# Altium schematic sheet SDEC944-xD_SirŠnes_(alim+commande+ouverture).SchDoc: Sirènes (alim+commande+ouverture capot)
size 393 x 270 mm; CompanyName: Seccom; Address1: 521, rue du capt. François Garbit; Address2: 69440 Mornant; Address3: seccom@seccom.fr; Address4: www.seccom.fr; DocumentNumber: 12; SheetNumber: 12; SheetTotal: 22; PageSetup: Record=PageOptions|CenterHorizontal=True|CenterVertical=True|PrintScale=0.74|XCorrection=1.00|YCorrection=1.00|PrintKind=0|BorderSize=5000000|LeftOffset=0|BottomOffset=0|Orientation=2|PaperLength=1000|PaperWidth=1000|Scale=100|PaperSource=7|PrintQuality=-4|MediaType=1|DitherType=10|PaperKind=A4|PrintScaleMode=1
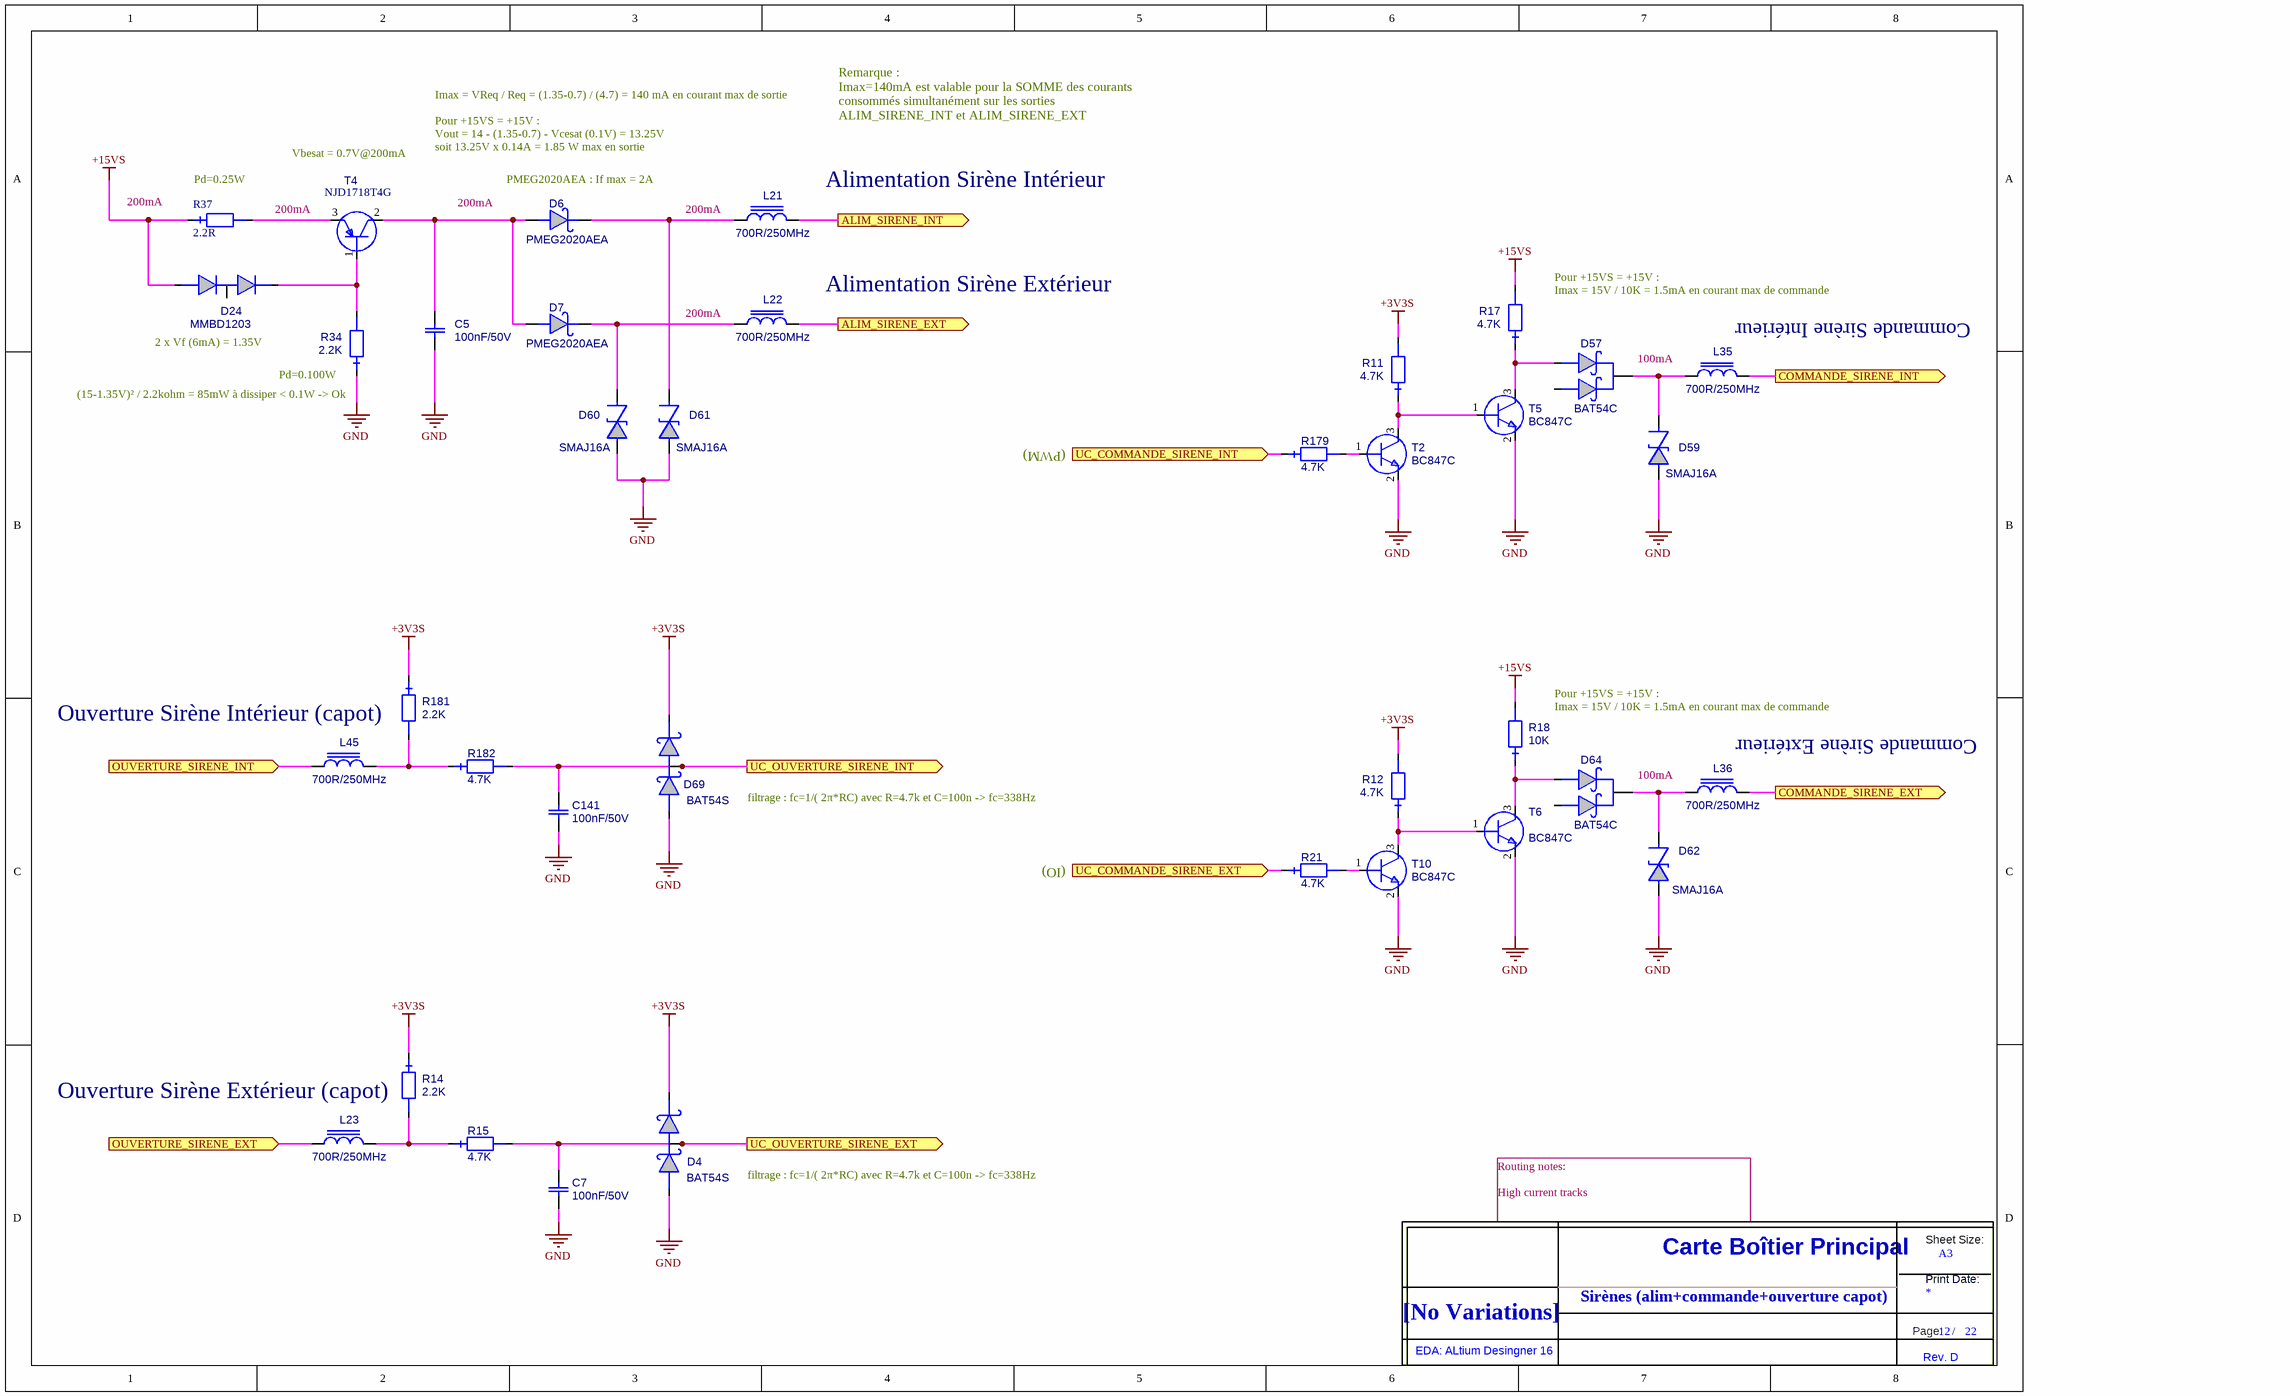
[diagram p0: SDEC944-xD_SirŠnes_(alim+commande+ouverture).SchDoc]

## Parts
C5  value 100nF/50V  [0603_ReflowSoldering_CAP]  (hidden comment: C_0603_X7R_10%_100N-50V)
C7  value 100nF/50V  [0603_ReflowSoldering_CAP]  (hidden comment: C_0603_X7R_10%_100N-50V)
C141  value 100nF/50V  [0603_ReflowSoldering_CAP]  (hidden comment: C_0603_X7R_10%_100N-50V)
D4  BAT54S  [SOT23_3L_ReflowSoldering]
D6  PMEG2020AEA  [SOD323_ReflowSoldering]
D7  PMEG2020AEA  [SOD323_ReflowSoldering]
D24  MMBD1203  [SOT23_3L_ReflowSoldering]
D57  BAT54C  [SOT23_3L_ReflowSoldering]
D59  SMAJ16A  [DO214AC-SMA-P_ReflowSoldering]
D60  SMAJ16A  [DO214AC-SMA-P_ReflowSoldering]
D61  SMAJ16A  [DO214AC-SMA-P_ReflowSoldering]
D62  SMAJ16A  [DO214AC-SMA-P_ReflowSoldering]
D64  BAT54C  [SOT23_3L_ReflowSoldering]
D69  BAT54S  [SOT23_3L_ReflowSoldering]
L21  value 700R/250MHz  [0603_ReflowSoldering_CAP]  (hidden comment: IND_FERRITE_0603_742792643)
L22  value 700R/250MHz  [0603_ReflowSoldering_CAP]  (hidden comment: IND_FERRITE_0603_742792643)
L23  value 700R/250MHz  [0603_ReflowSoldering_CAP]  (hidden comment: IND_FERRITE_0603_742792643)
L35  value 700R/250MHz  [0603_ReflowSoldering_CAP]  (hidden comment: IND_FERRITE_0603_742792643)
L36  value 700R/250MHz  [0603_ReflowSoldering_CAP]  (hidden comment: IND_FERRITE_0603_742792643)
L45  value 700R/250MHz  [0603_ReflowSoldering_CAP]  (hidden comment: IND_FERRITE_0603_742792643)
R11  value 4.7K  [0603_ReflowSoldering_RES]  (hidden comment: RES_0603_1%_100PPM_4.7K)
R12  value 4.7K  [0603_ReflowSoldering_RES]  (hidden comment: RES_0603_1%_100PPM_4.7K)
R14  value 2.2K  [0603_ReflowSoldering_RES]  (hidden comment: RES_0603_1%_100PPM_2.2K)
R15  value 4.7K  [0603_ReflowSoldering_RES]  (hidden comment: RES_0603_1%_100PPM_4.7K)
R17  value 4.7K  [0603_ReflowSoldering_RES]  (hidden comment: RES_0603_1%_100PPM_4.7K)
R18  value 10K  [0603_ReflowSoldering_RES]  (hidden comment: RES_0603_1%_100PPM_10K)
R21  value 4.7K  [0603_ReflowSoldering_RES]  (hidden comment: RES_0603_1%_100PPM_4.7K)
R34  value 2.2K  [0603_ReflowSoldering_RES]  (hidden comment: RES_0603_1%_100PPM_2.2K)
R37  Resistance (Ohms): 2.2R  [1206_ReflowSoldering_RES]  (hidden comment: RES SMD 2.2 OHM 1% 1/4W 1206)
R179  value 4.7K  [0603_ReflowSoldering_RES]  (hidden comment: RES_0603_1%_100PPM_4.7K)
R181  value 2.2K  [0603_ReflowSoldering_RES]  (hidden comment: RES_0603_1%_100PPM_2.2K)
R182  value 4.7K  [0603_ReflowSoldering_RES]  (hidden comment: RES_0603_1%_100PPM_4.7K)
T2  BC847C  [SOT23_3L_ReflowSoldering]
T4  NJD1718T4G  [DPAK_Specifique_1]
T5  BC847C  [SOT23_3L_ReflowSoldering]
T6  BC847C  [SOT23_3L_ReflowSoldering]
T10  BC847C  [SOT23_3L_ReflowSoldering]
Title_new  DNI  (value not drawn)  (graphical)

## Ports
ALIM_SIRENE_EXT (out), ALIM_SIRENE_INT (out), COMMANDE_SIRENE_EXT (out), COMMANDE_SIRENE_INT (out), OUVERTURE_SIRENE_EXT (in), OUVERTURE_SIRENE_INT (in), UC_COMMANDE_SIRENE_EXT (in), UC_COMMANDE_SIRENE_INT (in), UC_OUVERTURE_SIRENE_EXT (out), UC_OUVERTURE_SIRENE_INT (out)

## Nets
+3V3S: D4.2 D69.2 R11.2 R12.2 R14.1 R181.1
+15VS: D24.1 R17.2 R18.2 R37.1
GND: C5.2 C7.2 C141.2 D4.1 D59.A D60.A D61.A D62.A D69.1 R34.1 T2.2(E) T5.2(E) T6.2(E) T10.2(E)
ALIM_SIRENE_EXT: L22.2 ; port ALIM_SIRENE_EXT
ALIM_SIRENE_INT: L21.2 ; port ALIM_SIRENE_INT
COMMANDE_SIRENE_EXT: L36.2 ; port COMMANDE_SIRENE_EXT
COMMANDE_SIRENE_INT: L35.2 ; port COMMANDE_SIRENE_INT
OUVERTURE_SIRENE_EXT: L23.1 ; port OUVERTURE_SIRENE_EXT
OUVERTURE_SIRENE_INT: L45.1 ; port OUVERTURE_SIRENE_INT
UC_COMMANDE_SIRENE_EXT: R21.1 ; port UC_COMMANDE_SIRENE_EXT
UC_COMMANDE_SIRENE_INT: R179.1 ; port UC_COMMANDE_SIRENE_INT
UC_OUVERTURE_SIRENE_EXT: C7.1 D4.3 R15.2 ; port UC_OUVERTURE_SIRENE_EXT
UC_OUVERTURE_SIRENE_INT: C141.1 D69.3 R182.2 ; port UC_OUVERTURE_SIRENE_INT
NetC5_1: C5.1 D6.A D7.A T4.2(C)
NetD6_K: D6.K D61.K L21.1
NetD7_K: D7.K D60.K L22.1
NetD24_2: D24.2 R34.2 T4.1(B)
NetD57_2: D57.2 R17.1 T5.3(C)
NetD57_3: D57.3 D59.K L35.1
NetD62_K: D62.K D64.3 L36.1
NetD64_2: D64.2 R18.1 T6.3(C)
NetL23_2: L23.2 R14.2 R15.1
NetL45_2: L45.2 R181.2 R182.1
NetR11_1: R11.1 T2.3(C) T5.1(B)
NetR12_1: R12.1 T6.1(B) T10.3(C)
NetR21_2: R21.2 T10.1(B)
NetR37_2: R37.2 T4.3(E)
NetR179_2: R179.2 T2.1(B)

Not connected (* = marked no-connect by the designer): D24 3; D57 1; D64 1

## Notes on the sheet
- Imax = VReq / Req = (1.35-0.7) / (4.7) = 140 mA en courant max de sortie
- Vbesat = 0.7V@200mA
- soit 13.25V x 0.14A = 1.85 W max en sortie
- Vout = 14 - (1.35-0.7) - Vcesat (0.1V) = 13.25V
- Pour +15VS = +15V :
- Remarque :
  Imax=140mA est valable pour la SOMME des courants consommés simultanément sur les sorties ALIM_SIRENE_INT et ALIM_SIRENE_EXT
- (near R37) 200mA
- (near R37) Pd=0.25W
- 200mA
- (near D6) PMEG2020AEA : If max = 2A
- (near L21) 200mA
- (near L21) Alimentation Sirène Intérieur
- Alimentation Sirène Extérieur
- (near R17) Imax = 15V / 10K = 1.5mA en courant max de commande
- (near R17) Pour +15VS = +15V :
- 2 x Vf (6mA) = 1.35V
- (near R34) Pd=0.100W
- (near L22) 200mA
- 100mA
- (near L35) Commande Sirène Intérieur
- (near R34) (15-1.35V)² / 2.2kohm = 85mW à dissiper < 0.1W -> Ok
- (PWM)
- (near R18) Pour +15VS = +15V :
- (near R181) Ouverture Sirène Intérieur (capot)
- (near R18) Imax = 15V / 10K = 1.5mA en courant max de commande
- (near L36) Commande Sirène Extérieur
- filtrage : fc=1/( 2π*RC) avec R=4.7k et C=100n -> fc=338Hz
- (IO)
- (near R14) Ouverture Sirène Extérieur (capot)
- Routing notes:
  High current tracks
- Sirènes (alim+commande+ouverture capot)
- (in symbol Title_new) Sheet Size:; Carte Boîtier Principal; A3; Print Date:; [No Variations]; Page:; /; EDA: ALtium Desingner 16; Rev. D

## Library data of the parts
C5 C7 C141 = C_0603_X7R_10%_100N-50V: Condensateur céramique, X7R, 10%, CMS 0603, 100nF/50V; Creation: FB (29/02/12); Boitier: 0603; Remarque: {Remarque}; Fabricant: Kemet; Ref Fab: C0603C104K5RAC; Coeff: 1; ComponentLink1URL: O:\_Documentation\Datasheets\Kemet\Condos_Ceramic_CMS.pdf; ComponentLink2URL: o:\_Documentation\Datasheets\_BOITIERS\PASSIF_CMS\; Config: *; ComponentLink1Description: Datasheet; ComponentLink2Description: Datasheet Boitier; Supplier 1: Farnell; Supplier Part Number 1: 1288255
D4 D69 = BAT54S: Diode Schottky double, BAT54 en série, Vrrm=30V, If=200mA, Vf=0.4Vmax, CMS; Creation: JMP 05/09/2002; Verification: GO (26/09/02); Reference: 000206/00; Boitier: SOT23_3L; Remarque: {Remarque}; Coeff: 1; Fabricant: NXP; ComponentLink1URL: O:\_Documentation\Datasheets\NXP\BAT54_series.pdf; ComponentLink2URL: o:\_Documentation\Datasheets\_BOITIERS\ACTIF_CMS\SOT\SOT_23_3P_(Schneider).PDF; Config: *; ComponentLink1Description: Datasheet; ComponentLink2Description: Datasheet Boitier; Ref Fab: BAT54S; Supplier 1: Farnell; Supplier Part Number 1: 1081194; Value: BAT54S; Supplier 2: Mouser; Supplier Part Number 2: 771-BAT54S-T/R
D6 D7 = PMEG2020AEA: Diode Schottky, Vrrm=20V, If=2A, Vf=0.45V, CMS; Creation: PDP (10/07/12); Boitier: SOD323; Remarque: {Remarque}; Coeff: 1; Fabricant: NXP; Verification: *; ComponentLink1URL: o:\_Documentation\Datasheets\NXP\PMEG2020AEA.PDF; ComponentLink2URL: o:\_Documentation\Datasheets\_BOITIERS\ACTIF_CMS\SOD\SOD_80_(MLL34)_(Schneider).PDF; Config: *; ComponentLink1Description: Datasheet; ComponentLink2Description: Datasheet Boitier; Ref Fab: PMEG2020AEA; Value: PMEG2020AEA
D24 = MMBD1203: Diode de Redressement double, en série, Vrrm=100V, If=200mA, Vf=1V, rapide (trr=4ns), CMS; Creation: LJ (28/04/11); Reference: 001730/00; Boitier: SOT23_3L; Remarque: {Remarque}; Coeff: 1; Fabricant: Fairchild; ComponentLink1URL: o:\_Documentation\Datasheets\Fairchild\MMBD1201-2-3-4-5.pdf; ComponentLink2URL: o:\_Documentation\Datasheets\_BOITIERS\ACTIF_CMS\SOT\SOT_23_3P_(Schneider).PDF; Config: *; ComponentLink1Description: Datasheet; ComponentLink2Description: Datasheet Boitier; Supplier 1: Farnell; Supplier 2: Mouser; Supplier Part Number 1: 1700901; Supplier Part Number 2: 512-MMBD1203; Ref Fab: MMBD1203; Value: MMBD1203
D57 D64 = BAT54C: Diode Schottky double, BAT54 cathode com, Vrrm=30V, If=300mA, Vf=0.4Vmax, CMS; Creation: LJ (14/05/02); Reference: 000597/00; Boitier: SOT23_3L; Remarque: {Remarque}; Coeff: 1; Fabricant: NXP; Verification: LJ (14/05/02); ComponentLink1URL: O:\_Documentation\Datasheets\NXP\BAT54_series.pdf; ComponentLink2URL: o:\_Documentation\Datasheets\_BOITIERS\ACTIF_CMS\SOT\SOT_23_3P_(Schneider).PDF; Config: *; ComponentLink1Description: Datasheet; ComponentLink2Description: Datasheet Boitier; Ref Fab: BAT54C; Supplier 1: Farnell; Supplier Part Number 1: 1081192; Value: BAT54C
D59-D62 = SMAJ16A: Diode Transil/TVS unidirectionnelle (A), Transzorb, 400W, 16V, CMS; Creation: ZA (29/07/13); Boitier: DO214AC/SMA; Remarque: {Remarque}; Coeff: 1; Fabricant: Bourns; ComponentLink1URL: o:\_Documentation\Datasheets\Bourns\SMAJ-74970.pdf; ComponentLink2URL: o:\_Documentation\Datasheets\_BOITIERS\ACTIF_CMS\SMx\SMB_(Schneider).lnk; Config: *; ComponentLink1Description: Datasheet; ComponentLink2Description: Datasheet Boitier; Ref Fab: SMAJ16A; Supplier 1: Farnell; Supplier Part Number 1: 1843352; Supplier 2: Mouser; Supplier Part Number 2: 652-SMAJ16A; Value: SMAJ16A
L21-L23 L35 L36 L45 = IND_FERRITE_0603_742792643: Inductance à ferrite multicouches CMS, imp=700R@250MHz, +/-25%, Rdc=350mR, I=400mA; Creation: PDP (02/08/12); Boitier: 0603; Coeff: 1; Fabricant: Wurth Elektronik; ComponentLink1URL: o:\_Documentation\Datasheets\Murata\Ferrite_BLM21P.pdf; Config: *; ComponentLink1Description: Datasheet; ComponentLink2Description: Datasheet Boitier; Ref Fab: 742792643; Supplier 1: Farnell; Supplier Part Number 1: 1800349
R11 R12 R15 R17 R21 R179 R182 = RES_0603_1%_100PPM_4.7K: Résistance, 0.100W, 1%, 100ppm, 75V, 4.7K; Creation: JPL (05/07/12); Boitier: 0603; Remarque: {Remarque}; Fabricant: Vishay; Ref Fab: CRCW06034K70FKEA; Coeff: 1; Verification: *; ComponentLink1URL: O:\_Documentation\Datasheets\Vishay\Resistances_D-CRCWe3.pdf; ComponentLink2URL: o:\_Documentation\Datasheets\_BOITIERS\PASSIF_CMS\; Config: *; ComponentLink1Description: Datasheet; ComponentLink2Description: Datasheet Boitier; Supplier 1: Farnell; Supplier 2: RadioSpares; Supplier Part Number 1: 1469807; Supplier Part Number 2: 6790484
R14 R34 R181 = RES_0603_1%_100PPM_2.2K: Résistance, 0.100W, 1%, 100ppm, 75V, 2.2K; Creation: JPL (05/07/12); Boitier: 0603; Remarque: {Remarque}; Fabricant: Vishay; Ref Fab: CRCW06032K20FKEA; Coeff: 1; Verification: *; ComponentLink1URL: O:\_Documentation\Datasheets\Vishay\Resistances_D-CRCWe3.pdf; ComponentLink2URL: o:\_Documentation\Datasheets\_BOITIERS\PASSIF_CMS\; Config: *; ComponentLink1Description: Datasheet; ComponentLink2Description: Datasheet Boitier; Supplier 1: Farnell; Supplier 2: RadioSpares; Supplier Part Number 1: 1469765; Supplier Part Number 2: 6790112
R18 = RES_0603_1%_100PPM_10K: Résistance, 0.100W, 1%, 100ppm, 75V, 10K; Creation: JPL (05/07/12); Boitier: 0603; Remarque: {Remarque}; Fabricant: Vishay; Ref Fab: CRCW060310K0FKEA; Coeff: 1; Verification: *; ComponentLink1URL: O:\_Documentation\Datasheets\Vishay\Resistances_D-CRCWe3.pdf; ComponentLink2URL: o:\_Documentation\Datasheets\_BOITIERS\PASSIF_CMS\; Config: *; ComponentLink1Description: Datasheet; ComponentLink2Description: Datasheet Boitier; Supplier 1: Farnell; Supplier 2: RadioSpares; Supplier Part Number 1: 1469748; Supplier Part Number 2: 6789667
R37 = RES SMD 2.2 OHM 1% 1/4W 1206: Manufacturer: Yageo; Manufacturer Part Number: AC1206FR-072R2L; Power (Watts): 0.25W, 1/4W; Temperature Coefficient: ±200ppm/°C; Value: 2R2; Supplier 1: Digi-Key; RoHS: RoHS Compliant; Category: Resistors; Stock 1: 9515; Pricing 1: 1=0.1, 10=0.066, 25=0.048, 100=0.0269, 250=0.02048, 500=0.0164, 1000=0.01207, 2500=0.01048 (USD); Packaging: Cut Tape (CT); Part Status: Active; Tolerance: ±1%; Composition: Thick Film; Features: Automotive AEC-Q200, Moisture Resistant; Operating Temperature: -55°C ~ 155°C; Package / Case: 1206 (3016 Metric); Supplier Device Package: 1206; Size / Dimension: 0.122" L x 0.063" W (3.10mm x 1.60mm); Height: 0.026" (0.65mm); Number of Terminations: 2; Failure Rate: -; ComponentLink1URL: http://www.yageo.com/NewPortal/yageodocoutput?fileName=/pdf/R-Chip/PYu-AC_51_RoHS_L_5.pdf; ComponentLink1Description: http://www.yageo.com/NewPortal/yageodocoutput?fileName=/pdf/R-Chip/PYu-AC_51_RoHS_L_5.pdf; Supplier Part Number 1: YAG3859CT-ND; Fabricant: Yageo; Ref Fab: AC1206FR-072R2L
T2 T5 T6 T10 = BC847C: Transistor NPN, Vce=50V, Ic=0.1A, hfe=420~800, 0.25W, CMS; Creation: GO (08/07/05); Verification: LJ (21/07/05); Reference: 000329/00; Boitier: SOT23_3L; Remarque: Complementaires aux BC856-860; Fabricant: NXP; Coeff: 1; Ref Fab: BC847C; ComponentLink1URL: O:\_Documentation\Datasheets\NXP\BC847.pdf; ComponentLink2URL: o:\_Documentation\Datasheets\_BOITIERS\ACTIF_CMS\SOT\SOT_23_3P_(Schneider).PDF; Config: *; ComponentLink1Description: Datasheet; Value: BC847C; Supplier 1: Farnell; Supplier Part Number 1: 1081235; ComponentLink2Description: Datasheet Boitier
T4 = NJD1718T4G: Transistor PNP, Vce=50V, Ic=3A, 15W, hfe=40~240, -65/+150°C, CMS; Creation: PDP (19/09/12); Boitier: DPAK; Remarque: {Remarque}; Coeff: 1; Fabricant: ON Semiconductor; ComponentLink1URL: o:\_Documentation\Datasheets\ON_Semiconductors\NJD1718-D.PDF; Config: *; ComponentLink1Description: Datasheet; ComponentLink2Description: Datasheet Boitier; Supplier 1: Mouser; Supplier Part Number 1: 863-NJD1718T4G; Ref Fab: NJD1718T4G; Value: NJD1718T4G
Title_new = Title_new